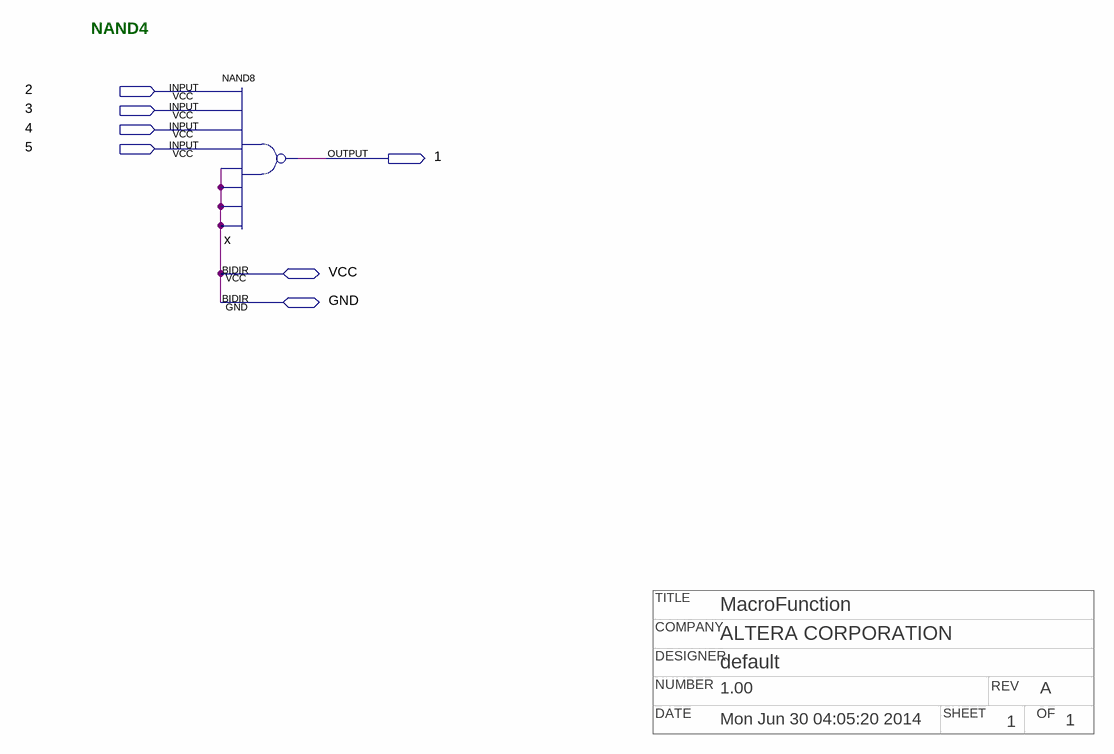
[diagram p0: schematic sheet]
// Quartus schematic npnand4.bdf as structural Verilog: 1 symbols, 7 pins
// Title block: TITLE: MacroFunction; COMPANY: ALTERA CORPORATION; DESIGNER: default; NUMBER: 1.00; REV: A; DATE: Mon Jun 30 04:05:20 2014; SHEET: 1; OF: 1
module npnand4 (
  input  \2 ,
  input  \3 ,
  input  \4 ,
  input  \5 ,
  inout  VCC,
  inout  GND,
  output \1 
);

  nand x (\1 , \2 , \3 , \4 , \5 , GND, GND, GND, GND);

  assign VCC = GND;

  // Notes on the sheet:
  //   NAND4
endmodule
